# Altium schematic sheet OhmCapMeter.SchDoc
size A4
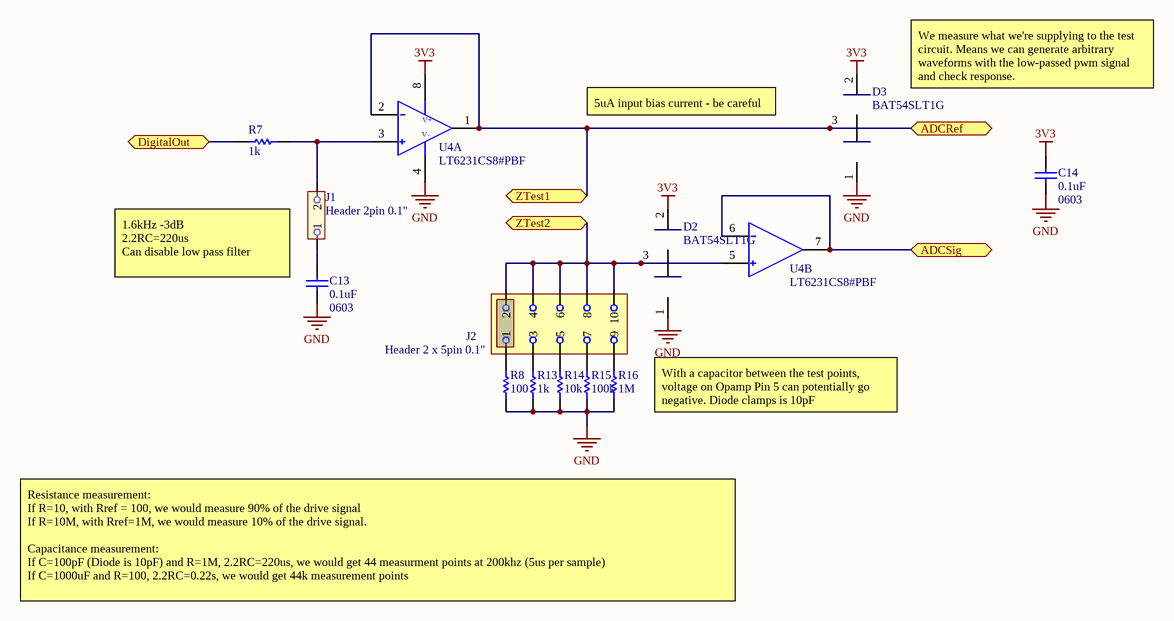
[diagram p0: OhmCapMeter.SchDoc]

## Parts
C13  0.1uF  [0603]
C14  0.1uF  [0603]
D2  BAT54SLT1G  [SOT23]
D3  BAT54SLT1G  [SOT23]
J1  Header 2pin 0.1"  [HDR1X2]
J2  Header 2 x 5pin 0.1"  [Header2x5]
R7  value 1k  [0603]  (hidden comment: Res0603)
R8  value 100  [0603]  (hidden comment: Res0603)
R13  value 1k  [0603]  (hidden comment: Res0603)
R14  value 10k  [0603]  (hidden comment: Res0603)
R15  value 100k  [0603]  (hidden comment: Res0603)
R16  value 1M  [0603]  (hidden comment: Res0603)
U4  LT6231CS8#PBF  [SO8]  (parts A,B of 2)

## Ports
ADCRef, ADCSig, DigitalOut, ZTest1, ZTest2

## Nets
3V3: C14.2 D2.2 D3.2 U4.8(V+)
GND: C13.1 C14.1 D2.1 D3.1 R8.1 R13.1 R14.1 R15.1 R16.1 U4.4(V-)
ADCRef: D3.3 U4.1(Out) U4.2(IN-) ; port ADCRef, port ZTest1
ADCSig: U4.6(IN-) U4.7(Out) ; port ADCSig
DigitalOut: R7.2 ; port DigitalOut
ZTest2: D2.3 J2.2 J2.4 J2.6 J2.8 J2.10 U4.5(IN+) ; port ZTest2
NetC13_2: C13.2 J1.1
NetJ1_2: J1.2 R7.1 U4.3(IN+)
NetJ2_1: J2.1 R8.2
NetJ2_3: J2.3 R13.2
NetJ2_5: J2.5 R14.2
NetJ2_7: J2.7 R15.2
NetJ2_9: J2.9 R16.2

## Notes on the sheet
- We measure what we're supplying to the test circuit. Means we can generate arbitrary waveforms with the low-passed pwm signal and check response.
- 5uA input bias current - be careful
- 1.6kHz -3dB
  2.2RC=220us
  Can disable low pass filter
- With a capacitor between the test points, voltage on Opamp Pin 5 can potentially go negative. Diode clamps is 10pF
- Resistance measurement:
  If R=10, with Rref = 100, we would measure 90% of the drive signal
  If R=10M, with Rref=1M, we would measure 10% of the drive signal.
  Capacitance measurement:
  If C=100pF (Diode is 10pF) and R=1M, 2.2RC=220us, we would get 44 measurment points at 200khz (5us per sample)
  If C=1000uF and R=100, 2.2RC=0.22s, we would get 44k measurement points

## Library data of the parts
C13 C14 = Cap0603: Capacitor, Ceramic, 0603; Manufacturer: Samsung Electro-Mechanics; Manufacturers Part Number: CL10A104KA8NNNC; Assembly Comments: none; Loaded: True; Value: 0.1uF 25V; TechInf: *; Param1: *; Part constraints: CL10A104KA8NNNC; Supplier 1: Digi-Key; Supplier Part Number 1: 1276-1857-1-ND; SupplierUnitCost: $0.02092
D2 D3 = DiodeClamp: Manufacturer: ON Semiconductor; Assembly Comments: none; Loaded: True; Manufacturers Part Number: BAT54SLT1G; Part constraints: BAT54SLT1G; Supplier 1: Digi-Key; Supplier Part Number 1: BAT54SLT1GOSCT-ND; SupplierUnitCost: $0.132
J1 = Header2: Header, 0.1", 2-Pin straight (Any equivalent - may need to be value added); Manufacturer: Wurth Electronics Inc.; Manufacturers Part Number: 61300211121; Assembly Comments: none; Loaded: True; Footprint: *; Part constraints: 61300211121; Supplier 1: Digi-Key; Supplier Part Number 1: 732-5315-ND; SupplierUnitCost: $0.10480
J2 = Header2x5: Header, 0.1", 2 row 5 pins; Manufacturer: Wurth Electronics Inc.; Manufacturers Part Number: 61301021121; Assembly Comments: none; Loaded: True; Footprint: *; Part constraints: 61301021121; Supplier 1: Digi-Key; Supplier Part Number 1: 732-2672-ND; SupplierUnitCost: $1.11012
R7 R13 = Res0603: Resistor; Manufacturer: Yageo; Manufacturers Part Number: RC0603FR-071KL; Assembly Comments: none; Loaded: True; TechInfo: *; Part constraints: RC0603FR-071KL; Supplier 1: Digi-Key; Supplier Part Number 1: 311-1.00KHRCT-ND; SupplierUnitCost: $0.016
R8 = Res0603: Resistor; Manufacturer: Yageo; Manufacturers Part Number: RC0603FR-07100RL; Assembly Comments: none; Loaded: True; TechInfo: *; Part constraints: RC0603FR-07100RL; Supplier 1: Digi-Key; Supplier Part Number 1: 311-100HRCT-ND; SupplierUnitCost: $0.016
R14 = Res0603: Resistor; Manufacturer: Yageo; Manufacturers Part Number: RC0603FR-0710KL; Assembly Comments: none; Loaded: True; TechInfo: *; Part constraints: RC0603FR-0710KL; Supplier 1: Digi-Key; Supplier Part Number 1: 311-10.0KHRCT-ND; SupplierUnitCost: $0.016
R15 = Res0603: Resistor; Manufacturer: Yageo; Manufacturers Part Number: AC0603FR-07100KL; Assembly Comments: none; Loaded: True; TechInfo: *; Part constraints: AC0603FR-07100KL; Supplier 1: Digi-Key; Supplier Part Number 1: 311-100KLDCT-ND; SupplierUnitCost: $0.019
R16 = Res0603: Resistor; Manufacturer: Yageo; Manufacturers Part Number: AC0603FR-071ML; Assembly Comments: none; Loaded: True; TechInfo: *; Part constraints: AC0603FR-071ML; Supplier 1: Digi-Key; Supplier Part Number 1: 311-1MLDCT-ND; SupplierUnitCost: $0.019
U4 = TSH82IYDT: Dual R-R Opamp Soic 8 70Mhz GBP; Manufacturer: Linear Technology/Analog Devices; Assembly Comments: none; Loaded: True; Supplier 1: Digi-Key; Supplier Part Number 1: LT6231CS8#PBF-ND; Part Constraints: LT6231CS8; Manufacturers Part Number: LT6231CS8; SupplierUnitCost: $3.5